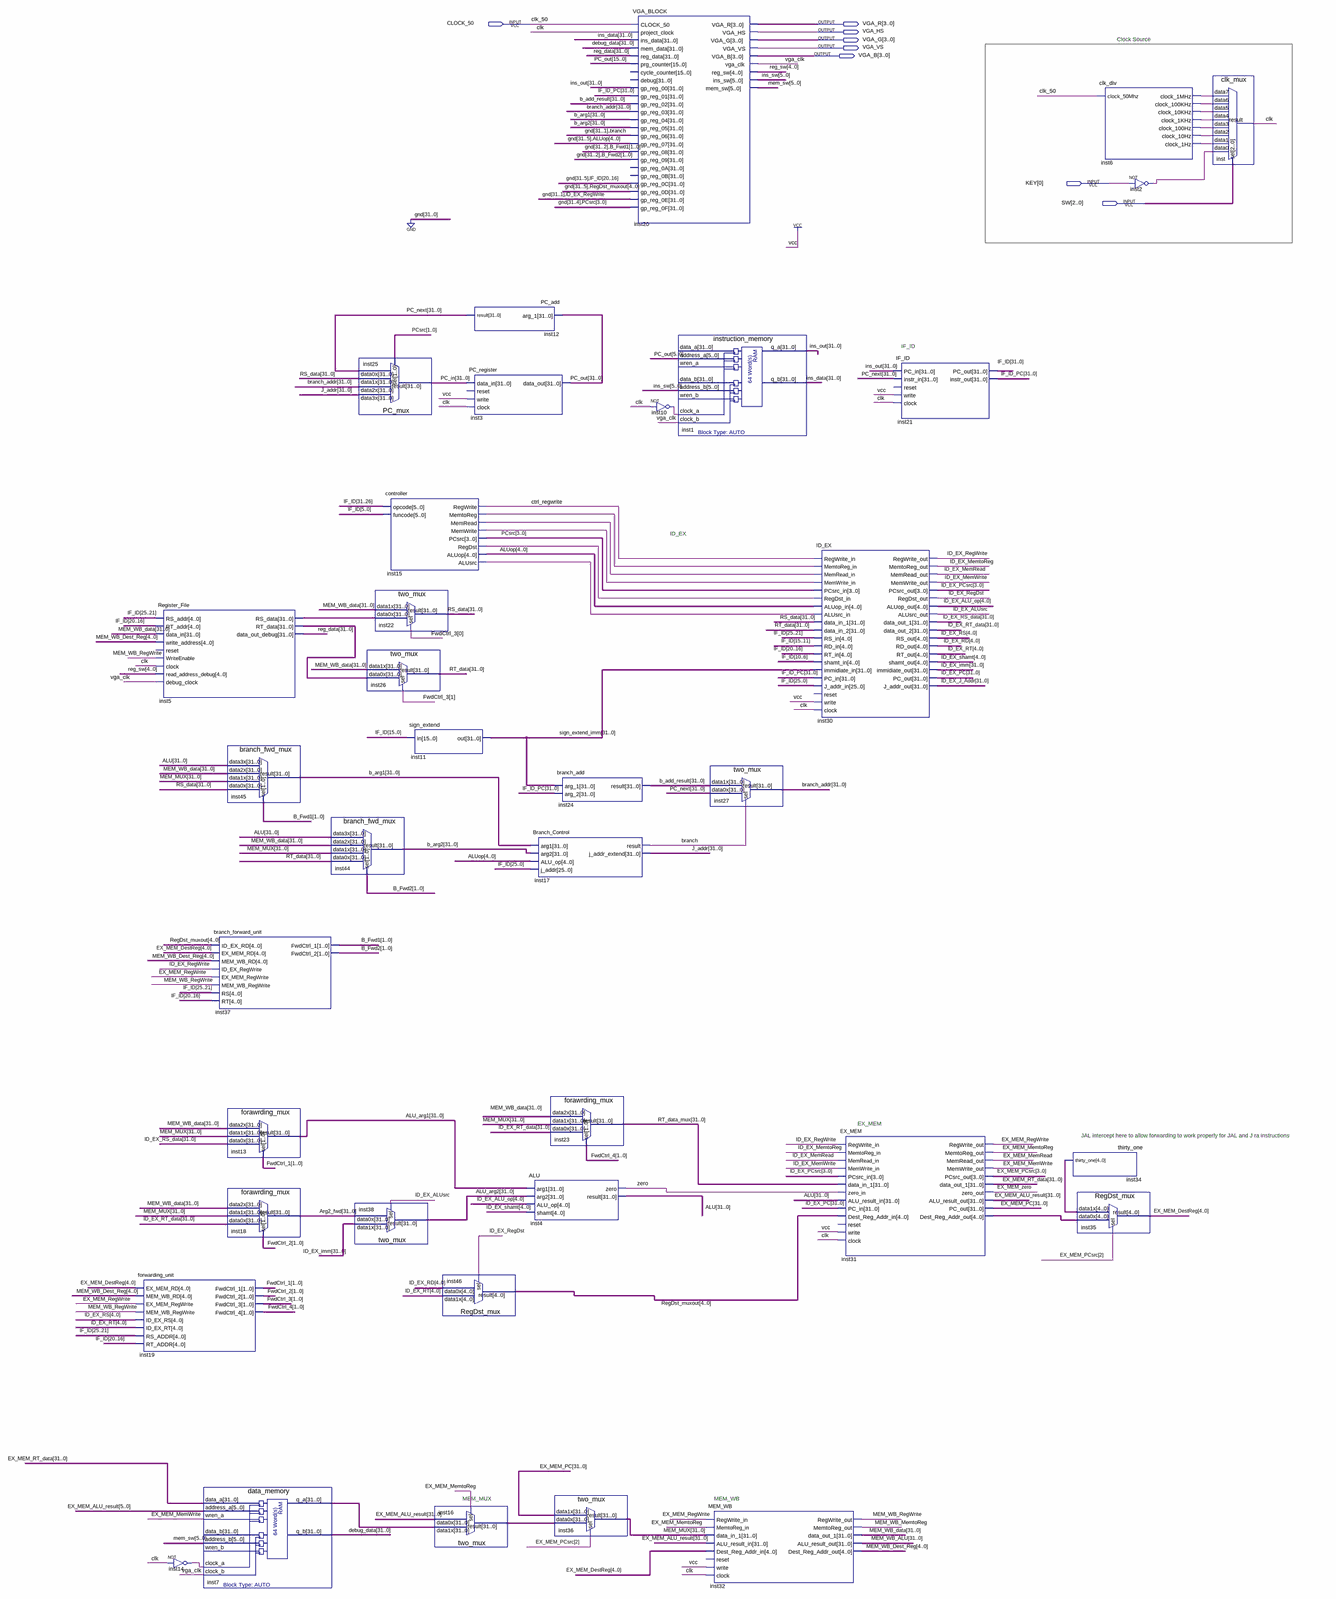
[diagram p0: schematic sheet, whole]
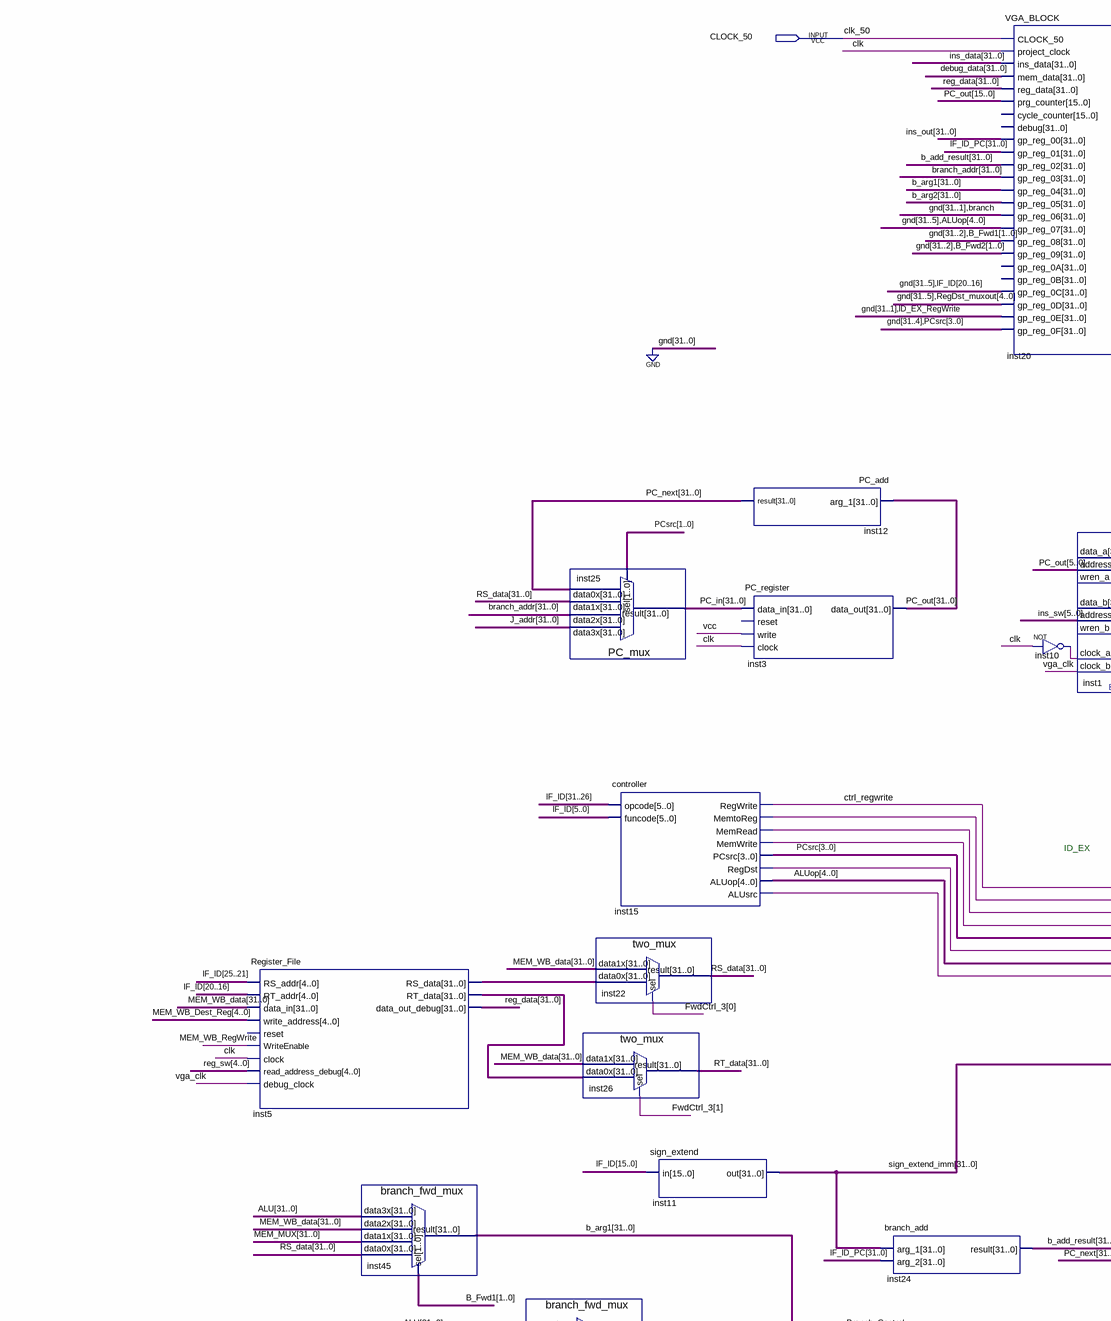
[diagram p1: schematic sheet, upper left part]
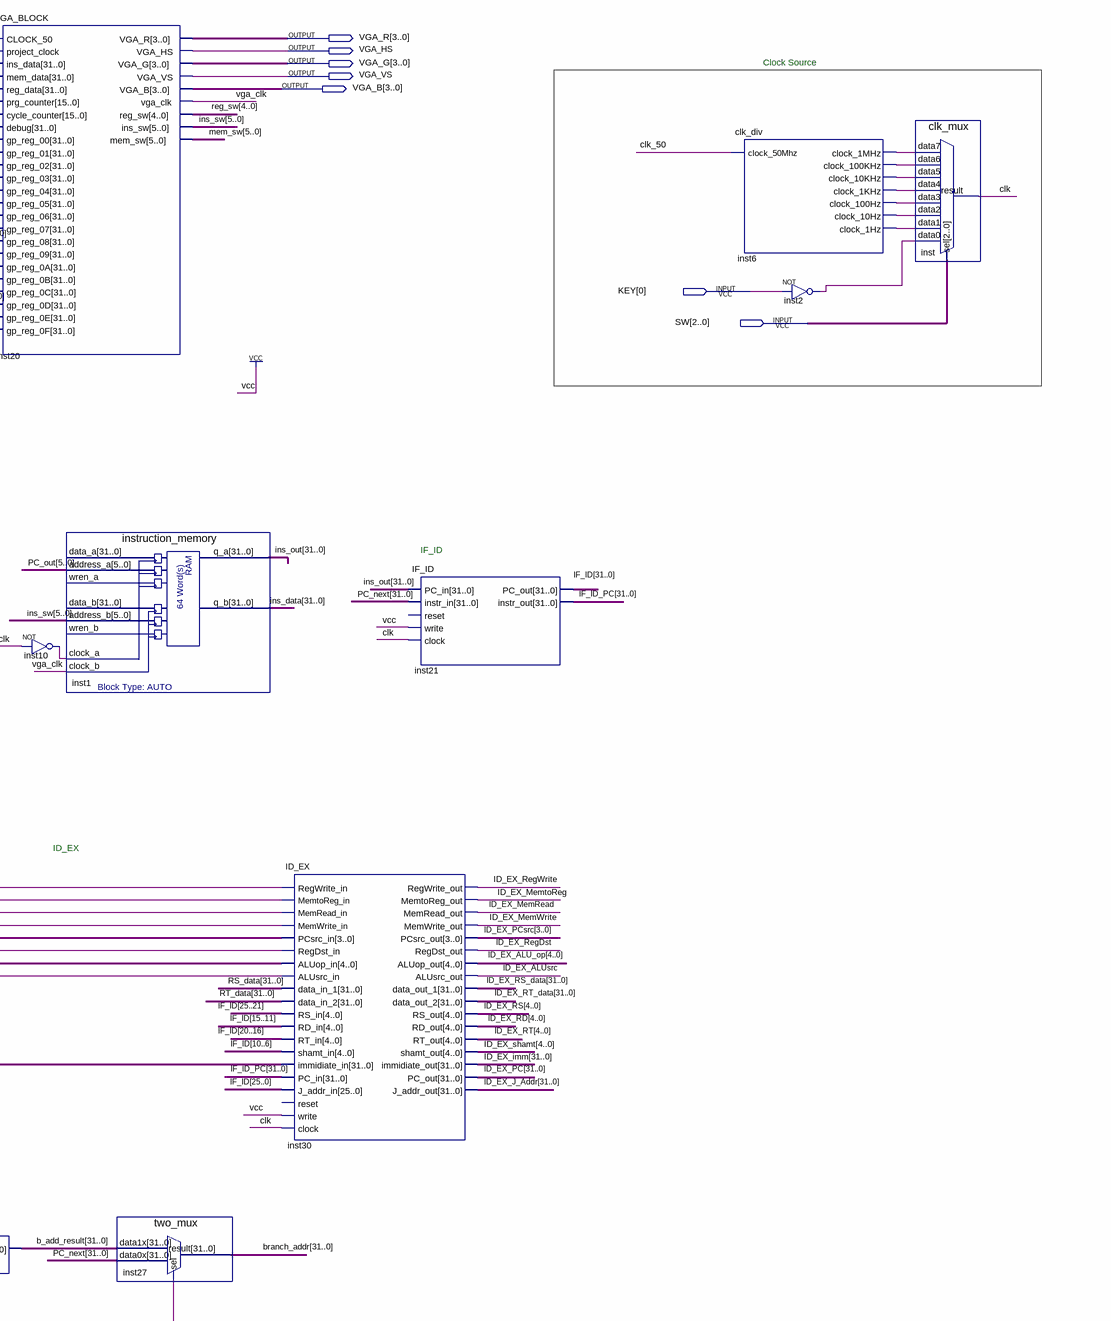
[diagram p2: schematic sheet, upper right part]
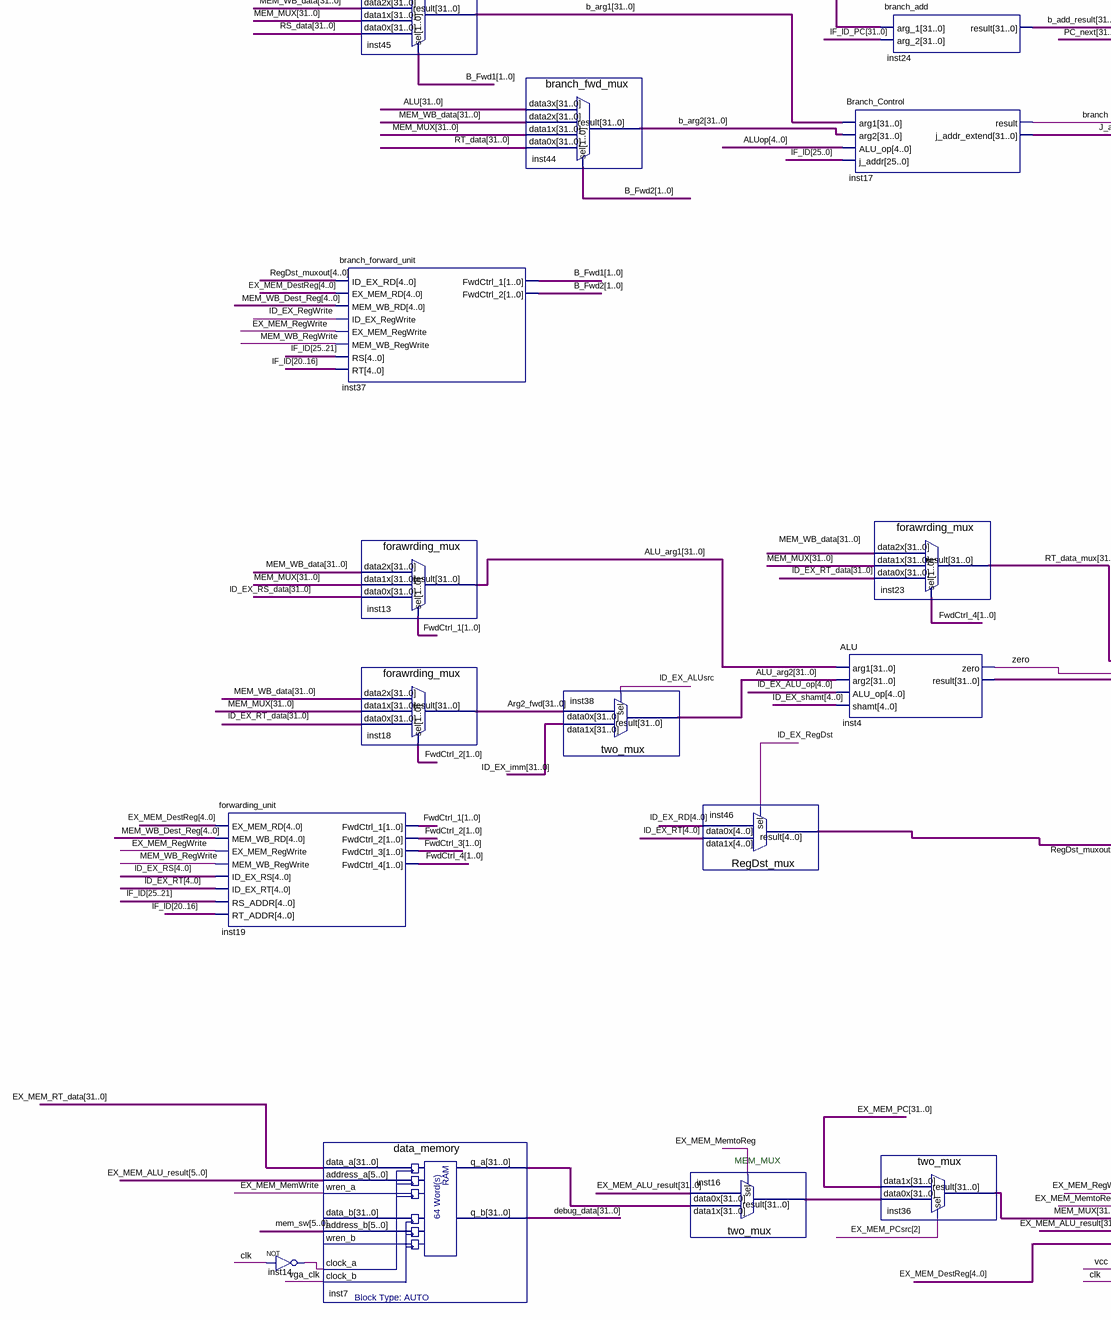
[diagram p3: schematic sheet, lower left part]
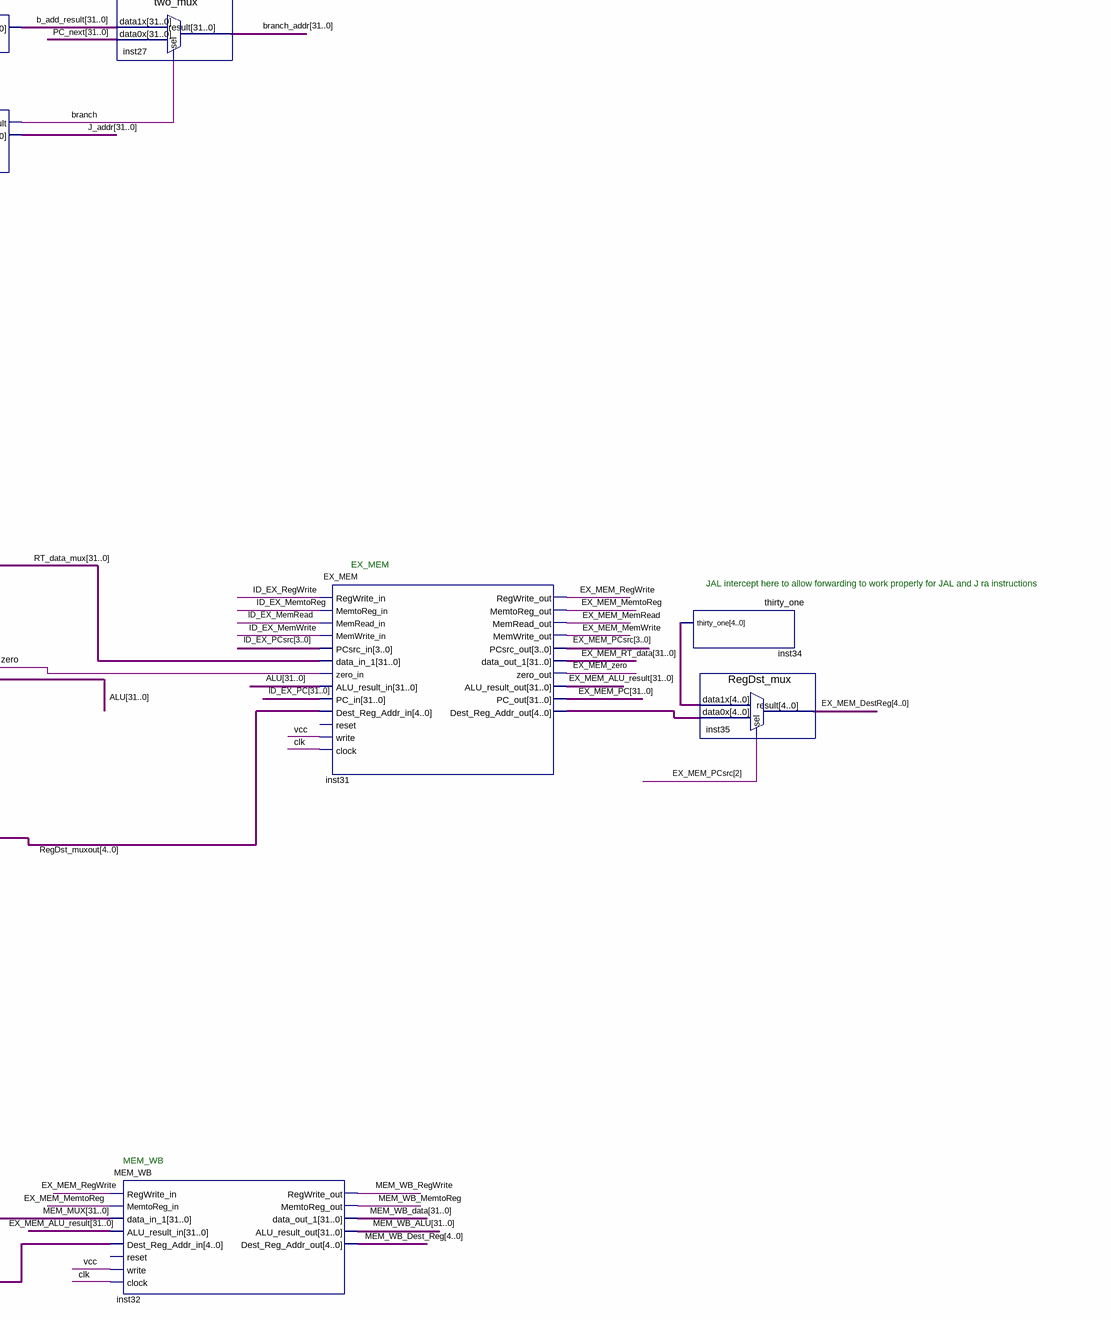
[diagram p4: schematic sheet, lower right part]
// Quartus schematic Five_Stage_Processor.bdf as structural Verilog: 37 symbols, 8 pins
module Five_Stage_Processor (
  input  CLOCK_50,
  input  [0:0] KEY,
  input  [2:0] SW,
  output [3:0] VGA_R,
  output VGA_HS,
  output [3:0] VGA_G,
  output VGA_VS,
  output [3:0] VGA_B
);

  wire branch, clk, ctrl_regwrite, EX_MEM_MemRead, EX_MEM_MemtoReg, EX_MEM_MemWrite, EX_MEM_RegWrite,
       EX_MEM_zero, ID_EX_ALUsrc, ID_EX_MemRead, ID_EX_MemtoReg, ID_EX_MemWrite, ID_EX_RegDst,
       ID_EX_RegWrite, inst2_out, inst6_clock_1hz, inst6_clock_1khz, inst6_clock_1mhz, inst6_clock_10hz,
       inst6_clock_10khz, inst6_clock_100hz, inst6_clock_100khz, inst10_out, inst14_out, inst15_alusrc,
       inst15_memread, inst15_memtoreg, inst15_memwrite, inst15_regdst, MEM_WB_MemtoReg, MEM_WB_RegWrite,
       vga_clk, zero;
  wire [1:0] B_Fwd1, B_Fwd2, FwdCtrl_1, FwdCtrl_2, FwdCtrl_3, FwdCtrl_4;
  wire [3:0] EX_MEM_PCsrc, ID_EX_PCsrc, PCsrc;
  wire [4:0] ALUop, EX_MEM_DestReg, ID_EX_ALU_op, ID_EX_RD, ID_EX_RS, ID_EX_RT, ID_EX_shamt,
       inst31_dest_reg_addr_out, inst34_thirty_one, MEM_WB_Dest_Reg, reg_sw, RegDst_muxout;
  wire [5:0] ins_sw, mem_sw;
  wire [31:0] ALU, ALU_arg1, ALU_arg2, Arg2_fwd, b_add_result, b_arg1, b_arg2, branch_addr, debug_data,
       EX_MEM_ALU_result, EX_MEM_PC, EX_MEM_RT_data, ID_EX_imm, ID_EX_J_Addr, ID_EX_PC, ID_EX_RS_data,
       ID_EX_RT_data, IF_ID, IF_ID_PC, ins_data, ins_out, inst5_rs_data, inst5_rt_data, inst7_q_a,
       inst16_result, J_addr, MEM_MUX, MEM_WB_ALU, MEM_WB_data, PC_in, PC_next, PC_out, reg_data, RS_data,
       RT_data, RT_data_mux, sign_extend_imm;

  Register_File inst5 (
    .RS_addr(IF_ID[25:21]), .RT_addr(IF_ID[20:16]), .data_in(MEM_WB_data), .write_address(MEM_WB_Dest_Reg),
    .WriteEnable(MEM_WB_RegWrite), .clock(clk), .read_address_debug(reg_sw), .debug_clock(vga_clk),
    .RS_data(inst5_rs_data), .RT_data(inst5_rt_data), .data_out_debug(reg_data));  // open: reset
  forwarding_unit inst19 (
    .EX_MEM_RD(EX_MEM_DestReg), .MEM_WB_RD(MEM_WB_Dest_Reg), .EX_MEM_RegWrite(EX_MEM_RegWrite),
    .MEM_WB_RegWrite(MEM_WB_RegWrite), .ID_EX_RS(ID_EX_RS), .ID_EX_RT(ID_EX_RT), .RS_ADDR(IF_ID[25:21]),
    .RT_ADDR(IF_ID[20:16]), .FwdCtrl_1(FwdCtrl_1), .FwdCtrl_2(FwdCtrl_2), .FwdCtrl_3(FwdCtrl_3),
    .FwdCtrl_4(FwdCtrl_4));
  not inst14 (inst14_out, clk);
  branch_fwd_mux inst45 (
    .data3x(ALU), .data2x(MEM_WB_data), .data1x(MEM_MUX), .data0x(RS_data), .sel(B_Fwd1), .result(b_arg1));
  branch_forward_unit inst37 (
    .ID_EX_RD(RegDst_muxout), .EX_MEM_RD(EX_MEM_DestReg), .MEM_WB_RD(MEM_WB_Dest_Reg),
    .ID_EX_RegWrite(ID_EX_RegWrite), .EX_MEM_RegWrite(EX_MEM_RegWrite), .MEM_WB_RegWrite(MEM_WB_RegWrite),
    .RS(IF_ID[25:21]), .RT(IF_ID[20:16]), .FwdCtrl_1(B_Fwd1), .FwdCtrl_2(B_Fwd2));
  forawrding_mux inst13 (
    .data2x(MEM_WB_data), .data1x(MEM_MUX), .data0x(ID_EX_RS_data), .sel(FwdCtrl_1), .result(ALU_arg1));
  forawrding_mux inst18 (
    .data2x(MEM_WB_data), .data1x(MEM_MUX), .data0x(ID_EX_RT_data), .sel(FwdCtrl_2), .result(Arg2_fwd));
  data_memory inst7 (
    .data_a(EX_MEM_RT_data), .address_a(EX_MEM_ALU_result[5:0]), .wren_a(EX_MEM_MemWrite),
    .address_b(mem_sw), .clock_a(inst14_out), .clock_b(vga_clk), .q_a(inst7_q_a), .q_b(debug_data));  // open: data_b, wren_b
  branch_fwd_mux inst44 (
    .data3x(ALU), .data2x(MEM_WB_data), .data1x(MEM_MUX), .data0x(RT_data), .sel(B_Fwd2), .result(b_arg2));
  two_mux inst38 (.data1x(ID_EX_imm), .data0x(Arg2_fwd), .sel(ID_EX_ALUsrc), .result(ALU_arg2));
  PC_mux inst25 (
    .data3x(J_addr), .data2x(branch_addr), .data1x(RS_data), .data0x(PC_next), .sel(PCsrc[1:0]),
    .result(PC_in));
  controller inst15 (
    .opcode(IF_ID[31:26]), .funcode(IF_ID[5:0]), .RegWrite(ctrl_regwrite), .MemtoReg(inst15_memtoreg),
    .MemRead(inst15_memread), .MemWrite(inst15_memwrite), .PCsrc(PCsrc), .RegDst(inst15_regdst),
    .ALUop(ALUop), .ALUsrc(inst15_alusrc));
  two_mux inst22 (.data1x(MEM_WB_data), .data0x(inst5_rs_data), .sel(FwdCtrl_3[0]), .result(RS_data));
  two_mux inst26 (.data1x(MEM_WB_data), .data0x(inst5_rt_data), .sel(FwdCtrl_3[1]), .result(RT_data));
  sign_extend inst11 (.in(IF_ID[15:0]), .out(sign_extend_imm));
  RegDst_mux inst46 (.data1x(ID_EX_RT), .data0x(ID_EX_RD), .sel(ID_EX_RegDst), .result(RegDst_muxout));
  two_mux inst16 (.data1x(inst7_q_a), .data0x(EX_MEM_ALU_result), .sel(EX_MEM_MemtoReg), .result(inst16_result));
  PC_add inst12 (.arg_1(PC_out), .result(PC_next));
  PC_register inst3 (.data_in(PC_in), .write(1'b1), .clock(clk), .data_out(PC_out));  // open: reset
  Branch_Control inst17 (
    .arg1(b_arg1), .arg2(b_arg2), .ALU_op(ALUop), .j_addr(IF_ID[25:0]), .result(branch),
    .j_addr_extend(J_addr));
  ALU inst4 (.arg1(ALU_arg1), .arg2(ALU_arg2), .ALU_op(ID_EX_ALU_op), .shamt(ID_EX_shamt), .zero(zero), .result(ALU));
  branch_add inst24 (.arg_1(sign_extend_imm), .arg_2(IF_ID_PC), .result(b_add_result));
  forawrding_mux inst23 (
    .data2x(MEM_WB_data), .data1x(MEM_MUX), .data0x(ID_EX_RT_data), .sel(FwdCtrl_4), .result(RT_data_mux));
  two_mux inst36 (.data1x(EX_MEM_PC), .data0x(inst16_result), .sel(EX_MEM_PCsrc[2]), .result(MEM_MUX));
  VGA_BLOCK inst20 (
    .CLOCK_50(CLOCK_50), .project_clock(clk), .ins_data(ins_data), .mem_data(debug_data),
    .reg_data(reg_data), .prg_counter(PC_out[15:0]), .gp_reg_00(ins_out), .gp_reg_01(IF_ID_PC),
    .gp_reg_02(b_add_result), .gp_reg_03(branch_addr), .gp_reg_04(b_arg1), .gp_reg_05(b_arg2),
    .gp_reg_06({{31{1'b0}}, branch}), .gp_reg_07({{27{1'b0}}, ALUop}), .gp_reg_08({{30{1'b0}}, B_Fwd1}),
    .gp_reg_09({{30{1'b0}}, B_Fwd2}), .gp_reg_0C({{27{1'b0}}, IF_ID[20:16]}),
    .gp_reg_0D({{27{1'b0}}, RegDst_muxout}), .gp_reg_0E({{31{1'b0}}, ID_EX_RegWrite}),
    .gp_reg_0F({{28{1'b0}}, PCsrc}), .VGA_R(VGA_R), .VGA_HS(VGA_HS), .VGA_G(VGA_G), .VGA_VS(VGA_VS),
    .VGA_B(VGA_B), .vga_clk(vga_clk), .reg_sw(reg_sw), .ins_sw(ins_sw), .mem_sw(mem_sw));  // open: cycle_counter, debug, gp_reg_0A, gp_reg_0B
  not inst10 (inst10_out, clk);
  instruction_memory inst1 (
    .address_a(PC_out[5:0]), .address_b(ins_sw), .clock_a(inst10_out), .clock_b(vga_clk), .q_a(ins_out),
    .q_b(ins_data));  // open: data_a, wren_a, data_b, wren_b
  MEM_WB inst32 (
    .RegWrite_in(EX_MEM_RegWrite), .MemtoReg_in(EX_MEM_MemtoReg), .data_in_1(MEM_MUX),
    .ALU_result_in(EX_MEM_ALU_result), .Dest_Reg_Addr_in(EX_MEM_DestReg), .write(1'b1), .clock(clk),
    .RegWrite_out(MEM_WB_RegWrite), .MemtoReg_out(MEM_WB_MemtoReg), .data_out_1(MEM_WB_data),
    .ALU_result_out(MEM_WB_ALU), .Dest_Reg_Addr_out(MEM_WB_Dest_Reg));  // open: reset
  two_mux inst27 (.data1x(b_add_result), .data0x(PC_next), .sel(branch), .result(branch_addr));
  ID_EX inst30 (
    .RegWrite_in(ctrl_regwrite), .MemtoReg_in(inst15_memtoreg), .MemRead_in(inst15_memread),
    .MemWrite_in(inst15_memwrite), .PCsrc_in(PCsrc), .RegDst_in(inst15_regdst), .ALUop_in(ALUop),
    .ALUsrc_in(inst15_alusrc), .data_in_1(RS_data), .data_in_2(RT_data), .RS_in(IF_ID[25:21]),
    .RD_in(IF_ID[15:11]), .RT_in(IF_ID[20:16]), .shamt_in(IF_ID[10:6]), .immidiate_in(sign_extend_imm),
    .PC_in(IF_ID_PC), .J_addr_in(IF_ID[25:0]), .write(1'b1), .clock(clk), .RegWrite_out(ID_EX_RegWrite),
    .MemtoReg_out(ID_EX_MemtoReg), .MemRead_out(ID_EX_MemRead), .MemWrite_out(ID_EX_MemWrite),
    .PCsrc_out(ID_EX_PCsrc), .RegDst_out(ID_EX_RegDst), .ALUop_out(ID_EX_ALU_op), .ALUsrc_out(ID_EX_ALUsrc),
    .data_out_1(ID_EX_RS_data), .data_out_2(ID_EX_RT_data), .RS_out(ID_EX_RS), .RD_out(ID_EX_RD),
    .RT_out(ID_EX_RT), .shamt_out(ID_EX_shamt), .immidiate_out(ID_EX_imm), .PC_out(ID_EX_PC),
    .J_addr_out(ID_EX_J_Addr));  // open: reset
  EX_MEM inst31 (
    .RegWrite_in(ID_EX_RegWrite), .MemtoReg_in(ID_EX_MemtoReg), .MemRead_in(ID_EX_MemRead),
    .MemWrite_in(ID_EX_MemWrite), .PCsrc_in(ID_EX_PCsrc), .data_in_1(RT_data_mux), .zero_in(zero),
    .ALU_result_in(ALU), .PC_in(ID_EX_PC), .Dest_Reg_Addr_in(RegDst_muxout), .write(1'b1), .clock(clk),
    .RegWrite_out(EX_MEM_RegWrite), .MemtoReg_out(EX_MEM_MemtoReg), .MemRead_out(EX_MEM_MemRead),
    .MemWrite_out(EX_MEM_MemWrite), .PCsrc_out(EX_MEM_PCsrc), .data_out_1(EX_MEM_RT_data),
    .zero_out(EX_MEM_zero), .ALU_result_out(EX_MEM_ALU_result), .PC_out(EX_MEM_PC),
    .Dest_Reg_Addr_out(inst31_dest_reg_addr_out));  // open: reset
  IF_ID inst21 (
    .PC_in(ins_out), .instr_in(PC_next), .write(1'b1), .clock(clk), .PC_out(IF_ID), .instr_out(IF_ID_PC));  // open: reset
  thirty_one inst34 (.thirty_one(inst34_thirty_one));
  RegDst_mux inst35 (
    .data1x(inst34_thirty_one), .data0x(inst31_dest_reg_addr_out), .sel(EX_MEM_PCsrc[2]),
    .result(EX_MEM_DestReg));
  clk_div inst6 (
    .clock_50Mhz(CLOCK_50), .clock_1MHz(inst6_clock_1mhz), .clock_100KHz(inst6_clock_100khz),
    .clock_10KHz(inst6_clock_10khz), .clock_1KHz(inst6_clock_1khz), .clock_100Hz(inst6_clock_100hz),
    .clock_10Hz(inst6_clock_10hz), .clock_1Hz(inst6_clock_1hz));
  not inst2 (inst2_out, KEY[0]);
  clk_mux inst (
    .data7(inst6_clock_1mhz), .data6(inst6_clock_100khz), .data5(inst6_clock_10khz),
    .data4(inst6_clock_1khz), .data3(inst6_clock_100hz), .data2(inst6_clock_10hz), .data1(inst6_clock_1hz),
    .data0(inst2_out), .sel(SW), .result(clk));

  // Other names for the same wires on the sheet: clk_50 = CLOCK_50

  // Notes on the sheet:
  //   Clock Source
  //   IF_ID
  //   ID_EX
  //   EX_MEM
  //   JAL intercept here to allow forwarding to work properly for JAL and J ra instructions
  //   MEM_MUX
  //   MEM_WB
endmodule
